# Altium project PROC114E3_SCH.PrjPcb (part 10 of 22)

## Sheet 23.SchDoc
size 513 x 386 mm
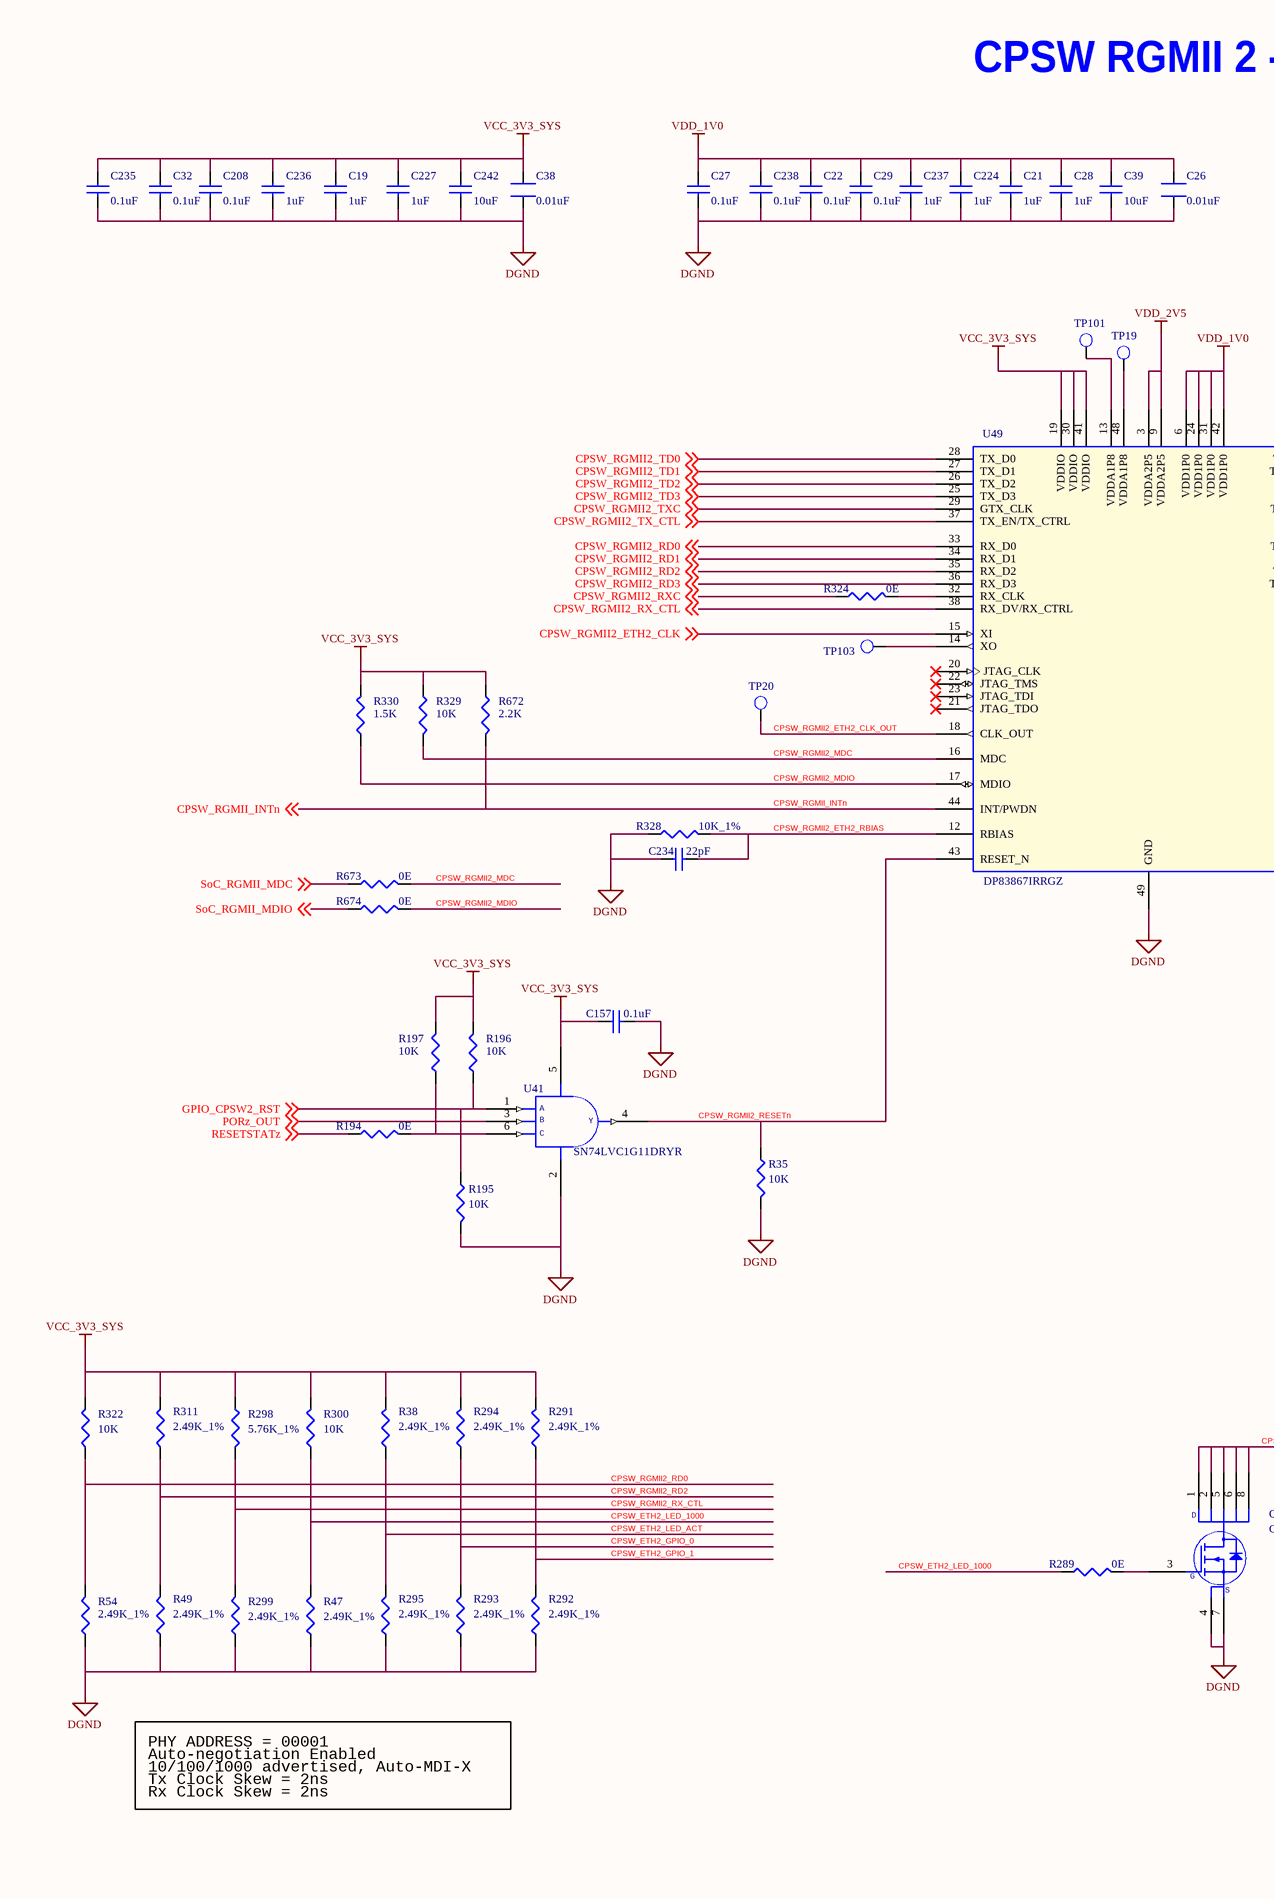
[diagram p35: 23.SchDoc, left]
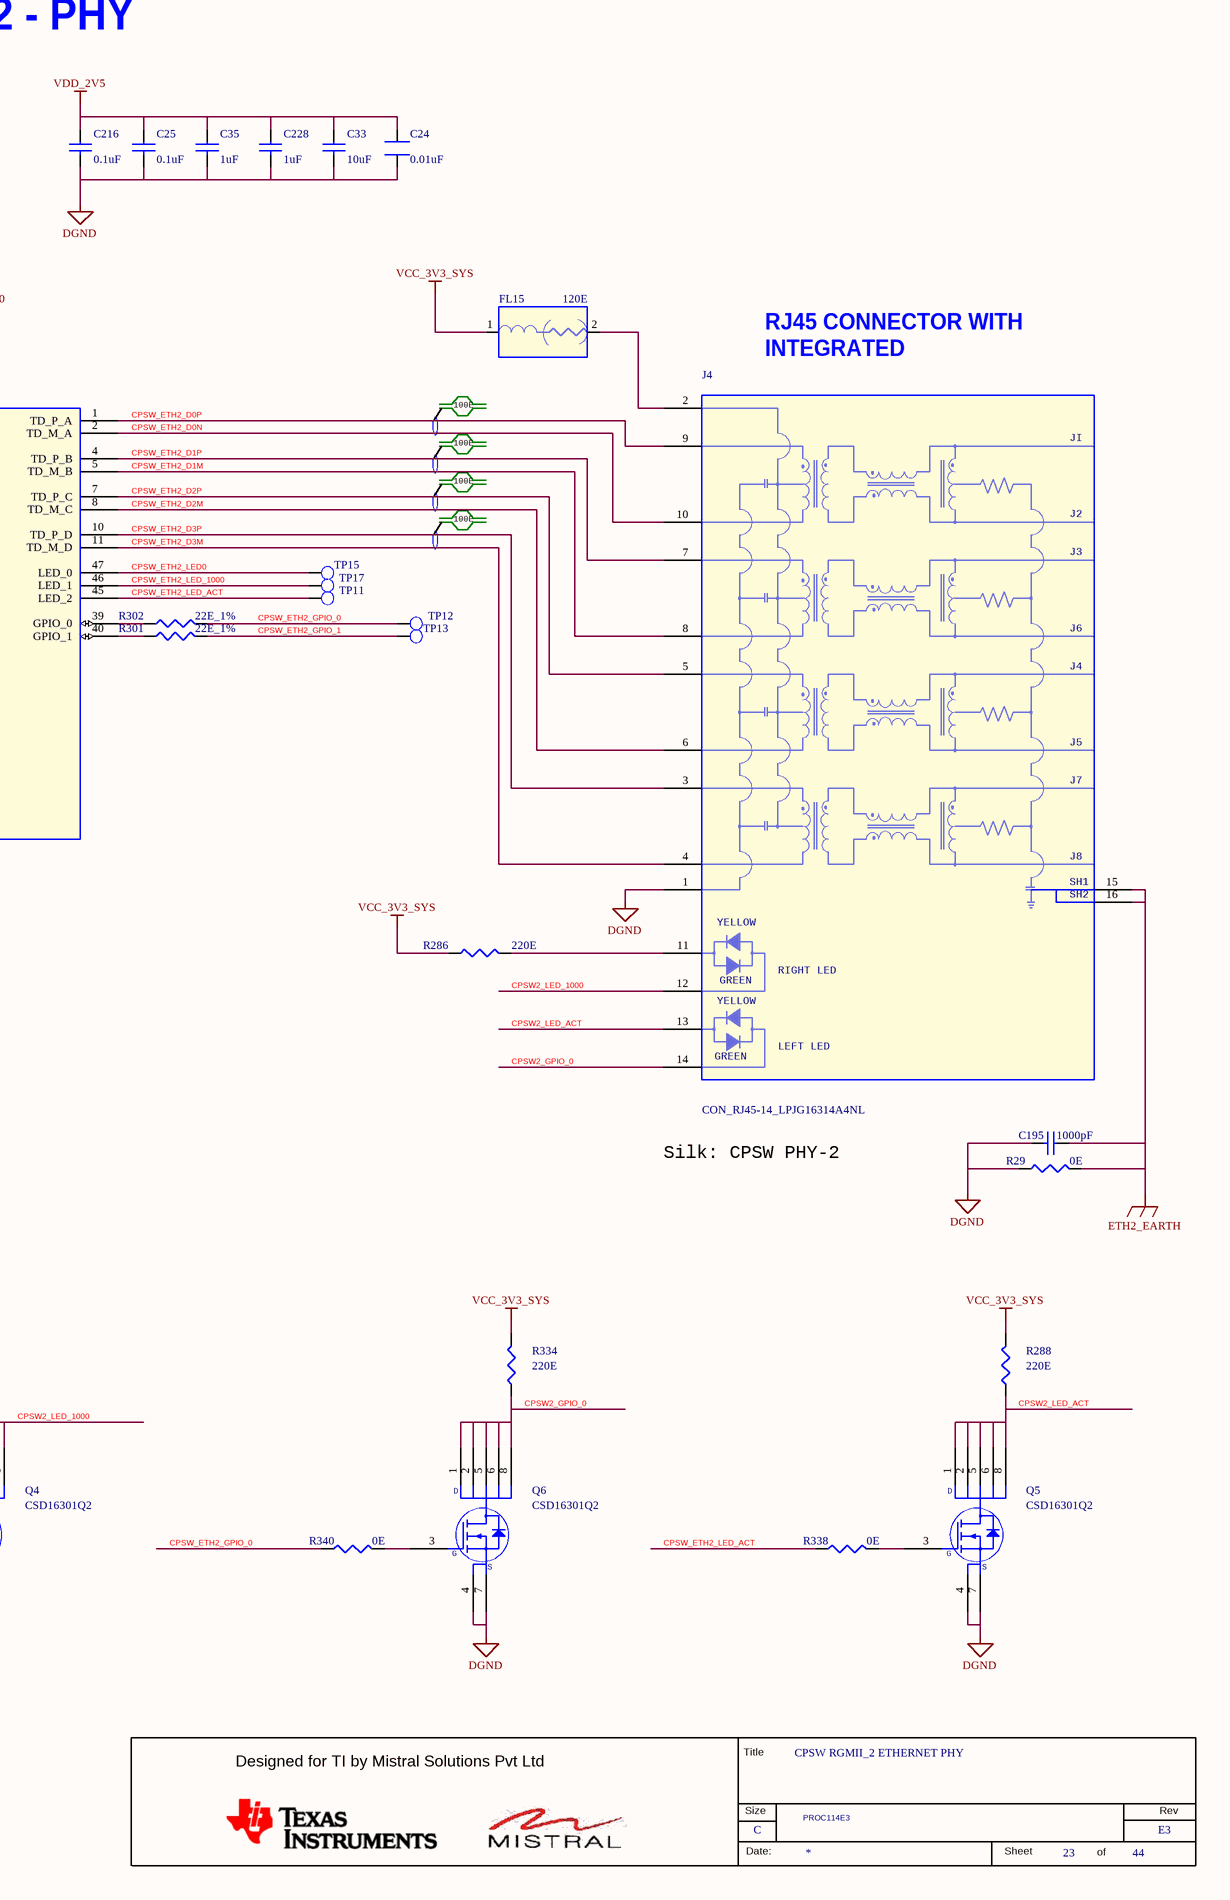
[diagram p36: 23.SchDoc, right]

### Parts
(Parts that share a designator on the sheet are numbered #1, #2 ... from top to bottom, then left to right.)
*#23  RevCode: E3  Title: CPSW RGMII_2 ETHERNET PHY  Page Size: C  Page Number: 23  Page Count: 44  Variant Name: PROC114E3  (hidden comment: MISTRAL_TITLEBLK_CSIZE)  (graphical)
C19  1uF  [CAP0201_0-5]
C21  1uF  [CAP0201_0-5]
C22  0.1uF  [CAP0201_0-5]
C24  0.01uF  [CAP0402N]
C25  0.1uF  [CAP0201_0-5]
C26  0.01uF  [CAP0402N]
C27  0.1uF  [CAP0201_0-5]
C28  1uF  [CAP0201_0-5]
C29  0.1uF  [CAP0201_0-5]
C32  0.1uF  [CAP0201_0-5]
C33  10uF  [CAP0402_0-75]
C35  1uF  [CAP0201_0-5]
C38  0.01uF  [CAP0402N]
C39  10uF  [CAP0402_0-75]
C157  0.1uF  [CAP0201_0-5]
C195  1000pF  [CAP1206_1-75]
C208  0.1uF  [CAP0201_0-5]
C216  0.1uF  [CAP0201_0-5]
C224  1uF  [CAP0201_0-5]
C227  1uF  [CAP0201_0-5]
C228  1uF  [CAP0201_0-5]
C234  22pF  [CAP0201_0-5]
C235  0.1uF  [CAP0201_0-5]
C236  1uF  [CAP0201_0-5]
C237  1uF  [CAP0201_0-5]
C238  0.1uF  [CAP0201_0-5]
C242  10uF  [CAP0402_0-75]
FL15  120E  [EMIFIL_BLM15P_0402]
J4  CON_RJ45-14_LPJG16314A4NL  [CON_RJ45-14_LPJG16314A4NL_S_R_T_13-6]
Q4  CSD16301Q2  [WSON6_CSD13202Q2_80X80_0-8]
Q5  CSD16301Q2  [WSON6_CSD13202Q2_80X80_0-8]
Q6  CSD16301Q2  [WSON6_CSD13202Q2_80X80_0-8]
R29  0E  [RES0603_0-75]
R35  10K  [RES0201_0-5]
R38  2.49K_1%  [RES0402_0-5]
R47  2.49K_1%  [RES0402_0-5]
R49  2.49K_1%  [RES0402_0-5]
R54  2.49K_1%  [RES0402_0-5]
R194  0E  [RES0402_0-5]
R195  10K  [RES0201_0-5]
R196  10K  [RES0201_0-5]
R197  10K  [RES0201_0-5]
R286  220E  [RES0402_0-5]
R288  220E  [RES0402_0-5]
R289  0E  [RES0402_0-5]
R291  2.49K_1%  [RES0402_0-5]
R292  2.49K_1%  [RES0402_0-5]
R293  2.49K_1%  [RES0402_0-5]
R294  2.49K_1%  [RES0402_0-5]
R295  2.49K_1%  [RES0402_0-5]
R298  5.76K_1%  [RES0402_0-5]
R299  2.49K_1%  [RES0402_0-5]
R300  10K  [RES0201_0-5]
R301  22E_1%  [RES0201_0-5]
R302  22E_1%  [RES0201_0-5]
R311  2.49K_1%  [RES0402_0-5]
R322  10K  [RES0201_0-5]
R324  0E  [RES0402_0-5]
R328  10K_1%  [RES0201_0-5]
R329  10K  [RES0201_0-5]
R330  1.5K  [RES0201_0-5]
R334  220E  [RES0402_0-5]
R338  0E  [RES0402_0-5]
R340  0E  [RES0402_0-5]
R672  2.2K  [RES0201_0-5]
R673  0E  [RES0402_0-5]
R674  0E  [RES0402_0-5]
TP11  TP20_SMD  [TP20_SMD]  (value not drawn)
TP12  TP20_SMD  [TP20_SMD]  (value not drawn)
TP13  TP20_SMD  [TP20_SMD]  (value not drawn)
TP15  TP20_SMD  [TP20_SMD]  (value not drawn)
TP17  TP20_SMD  [TP20_SMD]  (value not drawn)
TP19  TP20_SMD  [TP20_SMD]  (value not drawn)
TP20  TP20_SMD  [TP20_SMD]  (value not drawn)
TP101  TP20_SMD  [TP20_SMD]  (value not drawn)
TP103  TP20_SMD  [TP20_SMD]  (value not drawn)
U41  SN74LVC1G11DRYR  [SON6_SN74LVC2G17_40X60_0-6]
U49  DP83867IRRGZ  [QFN48_19-68_280X280_1]

### Nets
DGND: C19.2 C21.2 C22.2 C24.2 C25.2 C26.2 C27.2 C28.2 C29.2 C32.2 C33.2 C35.2 C38.2 C39.2 C157.2 C195.2 C208.2 C216.2 C224.2 C227.2 C228.2 C234.1 C235.2 C236.2 C237.2 C238.2 C242.2 J4.1(CH-GND) Q4.4(S1) Q4.7(S2) Q5.4(S1) Q5.7(S2) Q6.4(S1) Q6.7(S2) R29.2 R35.2 R47.1 R49.1 R54.1 R195.2 R292.1 R293.1 R295.1 R299.1 R328.2 U41.2(GND) U49.49(GND)
ETH2_EARTH: C195.1 J4.15(SH1) J4.16(SH2) R29.1
VCC_3V3_SYS: C19.1 C32.1 C38.1 C157.1 C208.1 C227.1 C235.1 C236.1 C242.1 FL15.1 R38.2 R196.2 R197.2 R286.1 R288.2 R291.2 R294.2 R298.1 R300.2 R311.2 R322.2 R329.1 R330.2 R334.2 R672.1 U41.5(VCC) U49.19(VDDIO) U49.30(VDDIO) U49.41(VDDIO)
VDD_1V0: C21.1 C22.1 C26.1 C27.1 C28.1 C29.1 C39.1 C224.1 C237.1 C238.1 U49.6(VDD1P0) U49.24(VDD1P0) U49.31(VDD1P0) U49.42(VDD1P0)
VDD_2V5: C24.1 C25.1 C33.1 C35.1 C216.1 C228.1 U49.3(VDDA2P5) U49.9(VDDA2P5)
CPSW2_GPIO_0: J4.14 Q6.1(D1) Q6.2(D2) Q6.5(D3) Q6.6(D4) Q6.8(D5) R334.1
CPSW2_LED_1000: J4.12 Q4.1(D1) Q4.2(D2) Q4.5(D3) Q4.6(D4) Q4.8(D5)
CPSW2_LED_ACT: J4.13 Q5.1(D1) Q5.2(D2) Q5.5(D3) Q5.6(D4) Q5.8(D5) R288.1
CPSW_ETH2_D0N: J4.10(MX0-) U49.2(TD_M_A)
CPSW_ETH2_D0P: J4.9(MX0+) U49.1(TD_P_A)
CPSW_ETH2_D1M: J4.8(MX1-) U49.5(TD_M_B)
CPSW_ETH2_D1P: J4.7(MX1+) U49.4(TD_P_B)
CPSW_ETH2_D2M: J4.6(MX2-) U49.8(TD_M_C)
CPSW_ETH2_D2P: J4.5(MX2+) U49.7(TD_P_C)
CPSW_ETH2_D3M: J4.4(MX3-) U49.11(TD_M_D)
CPSW_ETH2_D3P: J4.3(MX3+) U49.10(TD_P_D)
CPSW_ETH2_GPIO_0: R293.2 R294.1 R302.1 R340.1 TP12.1(TP)
CPSW_ETH2_GPIO_1: R291.1 R292.2 R301.1 TP13.1(TP)
CPSW_ETH2_LED0: TP15.1(TP) U49.47(LED_0)
CPSW_ETH2_LED_1000: R47.2 R289.1 R300.1 TP17.1(TP) U49.46(LED_1)
CPSW_ETH2_LED_ACT: R38.1 R295.2 R338.1 TP11.1(TP) U49.45(LED_2)
CPSW_RGMII2_ETH2_CLK: U49.15(XI) ; off-sheet CPSW_RGMII2_ETH2_CLK
CPSW_RGMII2_ETH2_CLK_OUT: TP20.1(TP) U49.18(CLK_OUT)
CPSW_RGMII2_ETH2_RBIAS: C234.2 R328.1 U49.12(RBIAS)
CPSW_RGMII2_MDC: R329.2 R673.2 U49.16(MDC)
CPSW_RGMII2_MDIO: R330.1 R674.2 U49.17(MDIO)
CPSW_RGMII2_RD0: R54.2 R322.1 U49.33(RX_D0) ; off-sheet CPSW_RGMII2_RD0
CPSW_RGMII2_RD1: U49.34(RX_D1) ; off-sheet CPSW_RGMII2_RD1
CPSW_RGMII2_RD2: R49.2 R311.1 U49.35(RX_D2) ; off-sheet CPSW_RGMII2_RD2
CPSW_RGMII2_RD3: U49.36(RX_D3) ; off-sheet CPSW_RGMII2_RD3
CPSW_RGMII2_RESETn: R35.1 U41.4(Y) U49.43(RESET_N)
CPSW_RGMII2_RX_CTL: R298.2 R299.2 U49.38(RX_DV/RX_CTRL) ; off-sheet CPSW_RGMII2_RX_CTL
CPSW_RGMII2_RXC: R324.1 ; off-sheet CPSW_RGMII2_RXC
CPSW_RGMII2_TD0: U49.28(TX_D0) ; off-sheet CPSW_RGMII2_TD0
CPSW_RGMII2_TD1: U49.27(TX_D1) ; off-sheet CPSW_RGMII2_TD1
CPSW_RGMII2_TD2: U49.26(TX_D2) ; off-sheet CPSW_RGMII2_TD2
CPSW_RGMII2_TD3: U49.25(TX_D3) ; off-sheet CPSW_RGMII2_TD3
CPSW_RGMII2_TX_CTL: U49.37(TX_EN/TX_CTRL) ; off-sheet CPSW_RGMII2_TX_CTL
CPSW_RGMII2_TXC: U49.29(GTX_CLK) ; off-sheet CPSW_RGMII2_TXC
CPSW_RGMII_INTn: R672.2 U49.44(INT/PWDN) ; off-sheet CPSW_RGMII_INTn
GPIO_CPSW2_RST: R195.1 R196.1 U41.1(A) ; off-sheet GPIO_CPSW2_RST
PORz_OUT: U41.3(B) ; off-sheet PORz_OUT
RESETSTATz: R194.1 ; off-sheet RESETSTATz
SoC_RGMII_MDC: R673.1 ; off-sheet SoC_RGMII_MDC
SoC_RGMII_MDIO: R674.1 ; off-sheet SoC_RGMII_MDIO
NetFL15_2: FL15.2 J4.2(VCC)
NetJ4_11: J4.11 R286.2
NetQ4_3: Q4.3(G) R289.2
NetQ5_3: Q5.3(G) R338.2
NetQ6_3: Q6.3(G) R340.2
NetR194_2: R194.2 R197.1 U41.6(C)
NetR301_2: R301.2 U49.40(GPIO_1)
NetR302_2: R302.2 U49.39(GPIO_0)
NetR324_2: R324.2 U49.32(RX_CLK)
NetTP19_1: TP19.1(TP) U49.48(VDDA1P8)
NetTP101_1: TP101.1(TP) U49.13(VDDA1P8)
NetTP103_1: TP103.1(TP) U49.14(XO)

Not connected (* = marked no-connect by the designer): U49 20(JTAG_CLK)* 21(JTAG_TDO)* 22(JTAG_TMS)* 23(JTAG_TDI)*

### Notes on the sheet
- CPSW RGMII 2 - PHY
- (near J4) RJ45 CONNECTOR WITH
  INTEGRATED MAGNETICS
- 100E
- Silk: CPSW PHY-2
- Rx Clock Skew = 2ns
- Tx Clock Skew = 2ns
- Auto-negotiation Enabled
- 10/100/1000 advertised, Auto-MDI-X
- PHY ADDRESS = 00001
- (in symbol CON_RJ45-14_LPJG16314A4NL) JI; J2; J3; J6; J5; J7; J8; YELLOW; RIGHT LED; GREEN; LEFT LED
- (in symbol MISTRAL_TITLEBLK_CSIZE) Title; Designed for TI by Mistral Solutions Pvt Ltd; Size; Rev; Date:; Sheet; of
- (in symbol MOSFET_CSD17313Q2) D; S

### Library data of the parts
*#23 = MISTRAL_TITLEBLK_CSIZE: Issue: 1.0; Page Create Date: March  8, 1995; Page Modify Date: *; Schematic Page Count: 44; Schematic Page Number: 23
C19 C21 C35 C228 C236 C237 = CAP_Dup2: as C71 on sheet 22; PCB Footprint: CAP0201_0-5; Footprint Ref: CAP0201_0-5; Library Ref: CAP; Footprint Path: Y:\MIS_DATABASE\Library\ALTIUM_TOOL\PCB_FOOTPRINTS\Altium_Footprint_Lib.PcbLib; Library Path: Y:\MIS_DATABASE\Library\ALTIUM_TOOL\SCHEMATICS_PARTS\MS_DISCRETE_Library.schlib; MECHANICAL 3D STEP FILE: CAP0201_0-5; Tolerance: 20%; Voltage: 16V; Package: 0201; Distributor_name: DIGIKEY; Distributor_part_number: 490-18654-1-ND; Height: 0.39MM; Weight: 0.33mg; Temperature: -55°C+85°C; Datasheet: Y:\MIS_DATABASE\DATASHEETS\CAPACITORS\GRM033R61C105ME15.PDF; Crtd /date: ALVY/260520; Chkd/date: MANIRAJA/300520
C22 C25 C29 C216 C238 = CAP_Dup2: as C68 on sheet 22; PCB Footprint: CAP0201_0-5; Footprint Path: Y:\MIS_DATABASE\Library\ALTIUM_TOOL\PCB_FOOTPRINTS\Altium_Footprint_Lib.PcbLib; Library Path: Y:\MIS_DATABASE\Library\ALTIUM_TOOL\SCHEMATICS_PARTS\MS_DISCRETE_Library.schlib; Footprint Ref: CAP0201_0-5; Library Ref: CAP; MECHANICAL 3D STEP FILE: CAP0201_0-5; Chkd/date: MANIRAJA/230118; Crtd /date: MANIRAJA/230118; Datasheet: Y:\MIS_DATABASE\DATASHEETS\CAPACITORS\GRM033R61C104KE14.PDF; Temperature: -55°C+85°C; Weight: 0.33mg; Height: 0.33MM; Distributor_part_number: 490-14305-1-ND; Distributor_name: DIGIKEY; Package: 0201; Voltage: 16V; Tolerance: 10%
C24 C38 = CAP_Dup3: as C113 on sheet 21; Library Ref: CAP; Tolerance: 10%; Voltage: 25V; Package: 0201; Distributor_name: DIGIKEY; Distributor_part_number: GRM033R61E103KA12J-ND; Height: 0.33MM; Datasheet: Y:\MIS_DATABASE\DATASHEETS\CAPACITORS\GRM033R61E103KA12.PDF; Crtd /date: MANIRAJA/230118; Chkd/date: MANIRAJA/230118; Weight: 0.33mg; Temperature: -55°C+85°C; MECHANICAL 3D STEP FILE: CAP0201_0-5; Footprint Ref: CAP0201_0-5; Library Path: Y:\MIS_DATABASE\Library\ALTIUM_TOOL\SCHEMATICS_PARTS\MS_DISCRETE_Library.schlib; Footprint Path: Y:\MIS_DATABASE\Library\ALTIUM_TOOL\PCB_FOOTPRINTS\Altium_Footprint_Lib.PcbLib
C26 = CAP_Dup3: as C30 on sheet 21; Footprint Path: Y:\MIS_DATABASE\Library\ALTIUM_TOOL\PCB_FOOTPRINTS\Altium_Footprint_Lib.PcbLib; Library Path: Y:\MIS_DATABASE\Library\ALTIUM_TOOL\SCHEMATICS_PARTS\MS_DISCRETE_Library.schlib; Footprint Ref: CAP0201_0-5; MECHANICAL 3D STEP FILE: CAP0201_0-5; Temperature: -55°C+85°C; Weight: 0.33mg; Chkd/date: MANIRAJA/230118; Crtd /date: MANIRAJA/230118; Datasheet: Y:\MIS_DATABASE\DATASHEETS\CAPACITORS\GRM033R61E103KA12.PDF; Height: 0.33MM; Distributor_part_number: GRM033R61E103KA12J-ND; Distributor_name: DIGIKEY; Package: 0201; Voltage: 25V; Tolerance: 10%; Library Ref: CAP
C27 C32 C157 C208 C235 = CAP_Dup2: as C63 on sheet 22; PCB Footprint: CAP0201_0-5; Tolerance: 10%; Voltage: 16V; Package: 0201; Distributor_name: DIGIKEY; Distributor_part_number: 490-14305-1-ND; Height: 0.33MM; Weight: 0.33mg; Temperature: -55°C+85°C; Datasheet: Y:\MIS_DATABASE\DATASHEETS\CAPACITORS\GRM033R61C104KE14.PDF; Crtd /date: MANIRAJA/230118; Chkd/date: MANIRAJA/230118; MECHANICAL 3D STEP FILE: CAP0201_0-5; Library Ref: CAP; Footprint Ref: CAP0201_0-5; Library Path: Y:\MIS_DATABASE\Library\ALTIUM_TOOL\SCHEMATICS_PARTS\MS_DISCRETE_Library.schlib; Footprint Path: Y:\MIS_DATABASE\Library\ALTIUM_TOOL\PCB_FOOTPRINTS\Altium_Footprint_Lib.PcbLib
C28 C224 C227 = CAP_Dup2: as C47 on sheet 19; PCB Footprint: CAP0201_0-5; Chkd/date: MANIRAJA/300520; Crtd /date: ALVY/260520; Datasheet: Y:\MIS_DATABASE\DATASHEETS\CAPACITORS\GRM033R61C105ME15.PDF; Temperature: -55°C+85°C; Weight: 0.33mg; Height: 0.39MM; Distributor_part_number: 490-18654-1-ND; Distributor_name: DIGIKEY; Package: 0201; Voltage: 16V; Tolerance: 20%; MECHANICAL 3D STEP FILE: CAP0201_0-5; Library Path: Y:\MIS_DATABASE\Library\ALTIUM_TOOL\SCHEMATICS_PARTS\MS_DISCRETE_Library.schlib; Footprint Path: Y:\MIS_DATABASE\Library\ALTIUM_TOOL\PCB_FOOTPRINTS\Altium_Footprint_Lib.PcbLib; Library Ref: CAP; Footprint Ref: CAP0201_0-5
C33 = CAP_Dup2: as C69 on sheet 22; PCB Footprint: CAP0402_0-75; Footprint Path: Y:\MIS_DATABASE\Library\ALTIUM_TOOL\PCB_FOOTPRINTS\Altium_Footprint_Lib.PcbLib; Library Path: Y:\MIS_DATABASE\Library\ALTIUM_TOOL\SCHEMATICS_PARTS\MS_DISCRETE_Library.schlib; Footprint Ref: CAP0402_0-75; Tolerance: 20%; Voltage: 10V; Package: 0402; Distributor_name: DIGIKEY; Distributor_part_number: 490-GRM155R61A106ME11DTR-ND; Height: 0.55MM; Datasheet: Y:\MIS_DATABASE\DATASHEETS\CAPACITORS\MURATA-GXX-SER_NOV17.PDF; Crtd /date: ALVY/260520; Chkd/date: MANIRAJA/300520; Weight: 3.1mg; Temperature: -55°C+85°C; MECHANICAL 3D STEP FILE: CAP0402_0-75; Library Ref: CAP
C39 = CAP_Dup2: CAP CERAMIC 10uF 10V 20% X5R 0402; Part_type: CAPACITORS\CERAMIC; Mfr_part_number: GRM155R61A106ME11D; Mfr_name: MURATA; Mistral Part No: 120013110019-R; Wattage: NA; Custom_Duty: 15%; Customs_HS_Code: 85322990; Project: QCS610_NANOSOM; PCB Footprint: CAP0402_0-75; Footprint Path: Y:\MIS_DATABASE\Library\ALTIUM_TOOL\PCB_FOOTPRINTS\Altium_Footprint_Lib.PcbLib; Library Path: Y:\MIS_DATABASE\Library\ALTIUM_TOOL\SCHEMATICS_PARTS\MS_DISCRETE_Library.schlib; Footprint Ref: CAP0402_0-75; MECHANICAL 3D STEP FILE: CAP0402_0-75; Temperature: -55°C+85°C; Weight: 3.1mg; Chkd/date: MANIRAJA/300520; Crtd /date: ALVY/260520; Datasheet: Y:\MIS_DATABASE\DATASHEETS\CAPACITORS\MURATA-GXX-SER_NOV17.PDF; Height: 0.55MM; Distributor_part_number: 490-GRM155R61A106ME11DTR-ND; Distributor_name: DIGIKEY; Package: 0402; Voltage: 10V; Tolerance: 20%; Library Ref: CAP
C195 = CAP_Dup2: as C327 on sheet 22; PCB Footprint: CAP1206_1-75; Tolerance: 10%; Voltage: 2KV; Package: 1206; Distributor_name: DIGIKEY; Distributor_part_number: 478-2956-1-ND; Height: 1.52MM; Weight: 16.2mg; Temperature: -55°C+125°C; Datasheet: Y:\MIS_DATABASE\DATASHEETS\CAPACITORS\AVX_HV-MLC.PDF; Crtd /date: MAZHAR/281106; Chkd/date: SHREESHAIL/291106; Library Ref: CAP; Footprint Ref: CAP1206_1-75; Library Path: Y:\MIS_DATABASE\Library\ALTIUM_TOOL\SCHEMATICS_PARTS\MS_DISCRETE_Library.schlib; Footprint Path: Y:\MIS_DATABASE\Library\ALTIUM_TOOL\PCB_FOOTPRINTS\Altium_Footprint_Lib.PcbLib; MECHANICAL 3D STEP FILE: CAP1206_1-75
C234 = CAP_Dup2: CAP CERAMIC 22pF 25V 1% C0G(NP0) 0201; Part_type: CAPACITORS\CERAMIC; Mfr_part_number: GRM0335C1E220FA01D; Mfr_name: MURATA; Mistral Part No: 120021070019-R; Custom_Duty: 15%; Customs_HS_Code: 85322990; Wattage: NA; Project: TI_AM335x SK_BRD; PCB Footprint: CAP0201_0-5; Footprint Path: Y:\MIS_DATABASE\Library\ALTIUM_TOOL\PCB_FOOTPRINTS\Altium_Footprint_Lib.PcbLib; Library Path: Y:\MIS_DATABASE\Library\ALTIUM_TOOL\SCHEMATICS_PARTS\MS_DISCRETE_Library.schlib; MECHANICAL 3D STEP FILE: CAP0201_0-5; Chkd/date: MANIRAJA/270721; Crtd /date: ALVY/260721; Datasheet: Y:\MIS_DATABASE\DATASHEETS\CAPACITORS\GRM0335C1E220FA01.PDF; Temperature: -55°C+125°C; Weight: 0.33mg; Height: 0.33MM; Library Ref: CAP; Distributor_part_number: 490-14545-1-ND; Distributor_name: DIGIKEY; Package: 0201; Voltage: 25V; Tolerance: 1%; Footprint Ref: CAP0201_0-5
C242 = CAP_Dup2: as C319 on sheet 22; PCB Footprint: CAP0402_0-75; Footprint Path: Y:\MIS_DATABASE\Library\ALTIUM_TOOL\PCB_FOOTPRINTS\Altium_Footprint_Lib.PcbLib; Library Path: Y:\MIS_DATABASE\Library\ALTIUM_TOOL\SCHEMATICS_PARTS\MS_DISCRETE_Library.schlib; Footprint Ref: CAP0402_0-75; Library Ref: CAP; MECHANICAL 3D STEP FILE: CAP0402_0-75; Temperature: -55°C+85°C; Weight: 3.1mg; Tolerance: 20%; Voltage: 10V; Package: 0402; Distributor_name: DIGIKEY; Distributor_part_number: 490-GRM155R61A106ME11DTR-ND; Height: 0.55MM; Datasheet: Y:\MIS_DATABASE\DATASHEETS\CAPACITORS\MURATA-GXX-SER_NOV17.PDF; Crtd /date: ALVY/260520; Chkd/date: MANIRAJA/300520
FL15 = EMIFILTER_IND: FERRITE CHIP 120E 2A 0402; Mistral Part No: 130013060022-R; Mfr_name: MURATA; Mfr_part_number: BLM15PX121SN1D; Part_type: FILTER; Project: GEN_3-8; Tolerance: 25%; Voltage: NA; Customs_HS_Code: 85369090; Custom_Duty: 24%; PCB Footprint: EMIFIL_BLM15P_0402; Wattage: NA; Package: 0402; Distributor_name: MOUSER; Distributor_part_number: 81-BLM15PX121SN1D; Library Ref: EMIFILTER_IND; Height: 0.55MM; Weight: NA; Temperature: -55°C+125°C; Datasheet: Y:\MIS_DATABASE\DATASHEETS\DISCRETES\INDUCTORS\BLM15X.PDF; Crtd /date: USMAN/170613; Chkd/date: NAVEED/241114
J4 = CON_RJ45-14_LPJG16314A4NL: CON RJ-45 FEMALE 14POS RT TH; Part_type: CONNECTOR\JACK; Mfr_name: LINK-PP; Mistral Part No: 150014060029-R; Custom_Duty: 24%; Customs_HS_Code: 85369090; Wattage: NA; Project: AEGIS; PCB Footprint: CON_RJ45-14_LPJG16314A4NL_S_R_T_13-6; Footprint Path: Y:\MIS_DATABASE\Library\ALTIUM_TOOL\PCB_FOOTPRINTS\Altium_Footprint_Lib.PcbLib; Library Path: Y:\MIS_DATABASE\Library\ALTIUM_TOOL\SCHEMATICS_PARTS\MS_CONNECTOR_Library.schlib; MECHANICAL 3D STEP FILE: CON_RJ45-14_LPJG16314A4NL_S_R_T_13-6; Chkd/date: VASANTHA/150714; Crtd /date: BALACHANDAR/120614; Datasheet: Y:\MIS_DATABASE\DATASHEETS\CONNECTORS\LPJG16314A4NL.PDF; Temperature: -0°C+70°C; Weight: NA; Height: 13.60MM; Footprint Ref: CON_RJ45-14_LPJG16314A4NL_S_R_T_13-6; Library Ref: CON_RJ45-14_LPJG16314A4NL; Distributor_part_number: NA; Distributor_name: NA; Package: THRU-HOLE; Voltage: NA; Tolerance: NA; Mfr_part_number: LPJG16314A4NL
Q4-Q6 = MOSFET_CSD17313Q2: as Q7 on sheet 22; Footprint Ref: WSON6_CSD13202Q2_80X80_0-8; Mfr_part_number: CSD16301Q2; Voltage: NA; Wattage: NA; Package: WSON6; Distributor_name: DIGIKEY; Distributor_part_number: 296-25260-1-ND; Library Ref: MOSFET_CSD17313Q2; PCB Footprint: WSON6_CSD13202Q2_80X80_0-8; Height: 0.80MM; Weight: 8.7mg; Temperature: -55°C+150°C; Datasheet: Y:\MIS_DATABASE\DATASHEETS\ICS\POWER\CSD16301Q2.PDF; Crtd /date: MANIRAJA/071220; Chkd/date: ALVY/071220; MECHANICAL 3D STEP FILE: WSON6_CSD13202Q2_80X80_0-8; Library Path: Y:\MIS_DATABASE\Library\ALTIUM_TOOL\SCHEMATICS_PARTS\MS_MOSFET_Library.schlib; Footprint Path: Y:\MIS_DATABASE\Library\ALTIUM_TOOL\PCB_FOOTPRINTS\Altium_Footprint_Lib.PcbLib
R29 = RESISTOR_Dup6: as R339 on sheet 22; PCB Footprint: RES0603_0-75; Footprint Path: Y:\MIS_DATABASE\Library\ALTIUM_TOOL\PCB_FOOTPRINTS\Altium_Footprint_Lib.PcbLib; Library Path: Y:\MIS_DATABASE\Library\ALTIUM_TOOL\SCHEMATICS_PARTS\MS_DISCRETE_Library.schlib; Footprint Ref: RES0603_0-75; Library Ref: RESISTOR; Tolerance: 5%; Wattage: 1/10W; Package: 0603; Distributor_name: DIGIKEY; Distributor_part_number: 311-0.0GRCT-ND; Height: 0.55MM; Weight: 2mg; Temperature: -55°C+155°C; Datasheet: Y:\MIS_DATABASE\DATASHEETS\RESISTORS\RCXXXXL-SER_MAR18.PDF; Crtd /date: BAVISH/180211; Chkd/date: MANIRAJA/051217; MECHANICAL 3D STEP FILE: RES0603_0-75
R35 R300 R322 = RESISTOR_Dup6: as R427 on sheet 18; PCB Footprint: RES0201_0-5; MECHANICAL 3D STEP FILE: RES0201_0-5; Chkd/date: MANIRAJA/050517; Crtd /date: MANIRAJA/050517; Datasheet: Y:\MIS_DATABASE\DATASHEETS\RESISTORS\RCXXXXL-SER_MAR18.PDF; Temperature: -55°C+125°C; Weight: 0.17mg; Height: 0.26MM; Distributor_part_number: 311-10KNCT-ND; Distributor_name: DIGIKEY; Package: 0201; Wattage: 1/20W; Tolerance: 5%; Library Ref: RESISTOR; Footprint Ref: RES0201_0-5; Library Path: Y:\MIS_DATABASE\Library\ALTIUM_TOOL\SCHEMATICS_PARTS\MS_DISCRETE_Library.schlib; Footprint Path: Y:\MIS_DATABASE\Library\ALTIUM_TOOL\PCB_FOOTPRINTS\Altium_Footprint_Lib.PcbLib
R38 R49 R291-R295 R299 R311 = RESISTOR_Dup6: as R84 on sheet 22; PCB Footprint: RES0402_0-5; Library Ref: RESISTOR; Chkd/date: VASANTHA/270516; Crtd /date: VASANTHA/270516; Datasheet: Y:\MIS_DATABASE\DATASHEETS\RESISTORS\RCXXXXL-SER_MAR18.PDF; Temperature: -55°C+155°C; Weight: 0.65mg; Height: 0.40MM; Distributor_part_number: 311-2.49KLRCT-ND; Distributor_name: DIGIKEY; Package: 0402; Wattage: 1/16W; Tolerance: 1%; Footprint Ref: RES0402_0-5; MECHANICAL 3D STEP FILE: RES0402_0-5; Library Path: Y:\MIS_DATABASE\Library\ALTIUM_TOOL\SCHEMATICS_PARTS\MS_DISCRETE_Library.schlib; Footprint Path: Y:\MIS_DATABASE\Library\ALTIUM_TOOL\PCB_FOOTPRINTS\Altium_Footprint_Lib.PcbLib
R47 R54 = RESISTOR_Dup6: as R76 on sheet 22; PCB Footprint: RES0402_0-5; Footprint Path: Y:\MIS_DATABASE\Library\ALTIUM_TOOL\PCB_FOOTPRINTS\Altium_Footprint_Lib.PcbLib; Library Path: Y:\MIS_DATABASE\Library\ALTIUM_TOOL\SCHEMATICS_PARTS\MS_DISCRETE_Library.schlib; MECHANICAL 3D STEP FILE: RES0402_0-5; Footprint Ref: RES0402_0-5; Tolerance: 1%; Wattage: 1/16W; Package: 0402; Distributor_name: DIGIKEY; Distributor_part_number: 311-2.49KLRCT-ND; Height: 0.40MM; Weight: 0.65mg; Temperature: -55°C+155°C; Datasheet: Y:\MIS_DATABASE\DATASHEETS\RESISTORS\RCXXXXL-SER_MAR18.PDF; Crtd /date: VASANTHA/270516; Chkd/date: VASANTHA/270516; Library Ref: RESISTOR
R194 = RESISTOR_Dup4: as R189 on sheet 22; PCB Footprint: RES0402_0-5; MECHANICAL 3D STEP FILE: RES0402_0-5; Chkd/date: VASANTHA/201216; Crtd /date: MUDDU/190810; Datasheet: Y:\MIS_DATABASE\DATASHEETS\RESISTORS\CRCW0603.PDF; Temperature: -55°C+155°C; Weight: 0.65mg; Height: 0.40MM; Distributor_part_number: 541-0.0JCT-ND; Distributor_name: DIGIKEY; Package: 0402; Wattage: 1/16W; Tolerance: NA; Library Ref: RESISTOR; Footprint Ref: RES0402_0-5; Library Path: Y:\MIS_DATABASE\Library\ALTIUM_TOOL\SCHEMATICS_PARTS\MS_DISCRETE_Library.schlib; Footprint Path: Y:\MIS_DATABASE\Library\ALTIUM_TOOL\PCB_FOOTPRINTS\Altium_Footprint_Lib.PcbLib
R195-R197 R329 = RESISTOR_Dup6: as R117 on sheet 19; PCB Footprint: RES0201_0-5; Footprint Path: Y:\MIS_DATABASE\Library\ALTIUM_TOOL\PCB_FOOTPRINTS\Altium_Footprint_Lib.PcbLib; Library Path: Y:\MIS_DATABASE\Library\ALTIUM_TOOL\SCHEMATICS_PARTS\MS_DISCRETE_Library.schlib; Footprint Ref: RES0201_0-5; Library Ref: RESISTOR; Tolerance: 5%; Wattage: 1/20W; Package: 0201; Distributor_name: DIGIKEY; Distributor_part_number: 311-10KNCT-ND; Height: 0.26MM; Weight: 0.17mg; Temperature: -55°C+125°C; Datasheet: Y:\MIS_DATABASE\DATASHEETS\RESISTORS\RCXXXXL-SER_MAR18.PDF; Crtd /date: MANIRAJA/050517; Chkd/date: MANIRAJA/050517; MECHANICAL 3D STEP FILE: RES0201_0-5
R286 = RESISTOR_Dup6: as R341 on sheet 22; PCB Footprint: RES0402_0-5; Footprint Path: Y:\MIS_DATABASE\Library\ALTIUM_TOOL\PCB_FOOTPRINTS\Altium_Footprint_Lib.PcbLib; Library Path: Y:\MIS_DATABASE\Library\ALTIUM_TOOL\SCHEMATICS_PARTS\MS_DISCRETE_Library.schlib; MECHANICAL 3D STEP FILE: RES0402_0-5; Temperature: -55°C+155°C; Weight: 0.8mg; Library Ref: RESISTOR; Chkd/date: VASANTHA/291216; Crtd /date: GEETHA/260406; Datasheet: Y:\MIS_DATABASE\DATASHEETS\RESISTORS\PAN-ERJSER_NOV17.PDF; Height: 0.40MM; Distributor_part_number: P220JCT-ND; Distributor_name: DIGIKEY; Package: 0402; Wattage: 1/10W; Tolerance: 5%; Footprint Ref: RES0402_0-5
R288 R334 = RESISTOR_Dup6: RES 220E 1/10W 5% 0402; Mistral Part No: 110009030506-R; Mfr_name: PANASONIC-ECG; Mfr_part_number: ERJ-2GEJ221X; Part_type: RESISTORS\FIXED; Project: RED EYE; Customs_HS_Code: 85332119; Custom_Duty: 15%; Voltage: NA; PCB Footprint: RES0402_0-5; Footprint Ref: RES0402_0-5; Tolerance: 5%; Wattage: 1/10W; Package: 0402; Distributor_name: DIGIKEY; Distributor_part_number: P220JCT-ND; Height: 0.40MM; Datasheet: Y:\MIS_DATABASE\DATASHEETS\RESISTORS\PAN-ERJSER_NOV17.PDF; Crtd /date: GEETHA/260406; Chkd/date: VASANTHA/291216; Library Ref: RESISTOR; Weight: 0.8mg; Temperature: -55°C+155°C; MECHANICAL 3D STEP FILE: RES0402_0-5; Library Path: Y:\MIS_DATABASE\Library\ALTIUM_TOOL\SCHEMATICS_PARTS\MS_DISCRETE_Library.schlib; Footprint Path: Y:\MIS_DATABASE\Library\ALTIUM_TOOL\PCB_FOOTPRINTS\Altium_Footprint_Lib.PcbLib
R289 R340 = RESISTOR_Dup6: as R72 on sheet 22; PCB Footprint: RES0402_0-5; Footprint Ref: RES0402_0-5; Voltage: NA; Wattage: 1/16W; Package: 0402; Distributor_name: DIGIKEY; Distributor_part_number: 541-0.0JCT-ND; Library Ref: RESISTOR; Height: 0.40MM; Weight: 0.65mg; Temperature: -55°C+155°C; Datasheet: Y:\MIS_DATABASE\DATASHEETS\RESISTORS\CRCW0603.PDF; Crtd /date: MUDDU/190810; Chkd/date: VASANTHA/201216; MECHANICAL 3D STEP FILE: RES0402_0-5; Library Path: Y:\MIS_DATABASE\Library\ALTIUM_TOOL\SCHEMATICS_PARTS\MS_DISCRETE_Library.schlib; Footprint Path: Y:\MIS_DATABASE\Library\ALTIUM_TOOL\PCB_FOOTPRINTS\Altium_Footprint_Lib.PcbLib
R298 = RESISTOR_Dup6: RES 5.76K 1/10W 1% 0402; Mistral Part No: 110009030945-R; Mfr_name: PANASONIC-ECG; Mfr_part_number: ERJ-2RKF5761X; Part_type: RESISTORS\FIXED; Project: CPB; Customs_HS_Code: 85332119; Custom_Duty: 15%; Voltage: NA; PCB Footprint: RES0402_0-5; Footprint Path: Y:\MIS_DATABASE\Library\ALTIUM_TOOL\PCB_FOOTPRINTS\Altium_Footprint_Lib.PcbLib; Library Path: Y:\MIS_DATABASE\Library\ALTIUM_TOOL\SCHEMATICS_PARTS\MS_DISCRETE_Library.schlib; Library Ref: RESISTOR; Tolerance: 1%; Wattage: 1/10W; Package: 0402; Distributor_name: DIGIKEY; Distributor_part_number: P5.76KLCT-ND; Height: 0.40MM; Datasheet: Y:\MIS_DATABASE\DATASHEETS\RESISTORS\PAN-ERJSER_NOV17.PDF; Crtd /date: USMAN/220808; Chkd/date: MAZHAR/150709; Footprint Ref: RES0402_0-5; Weight: 0.8mg; Temperature: -55°C+155°C; MECHANICAL 3D STEP FILE: RES0402_0-5
R301 R302 = RESISTOR_Dup1: as R353 on sheet 22; PCB Footprint: RES0201_0-5; Footprint Path: Y:\MIS_DATABASE\Library\ALTIUM_TOOL\PCB_FOOTPRINTS\Altium_Footprint_Lib.PcbLib; Library Path: Y:\MIS_DATABASE\Library\ALTIUM_TOOL\SCHEMATICS_PARTS\MS_DISCRETE_Library.schlib; MECHANICAL 3D STEP FILE: RES0201_0-5; Chkd/date: MANIRAJA/080319; Crtd /date: ALVY/080319; Datasheet: Y:\MIS_DATABASE\DATASHEETS\RESISTORS\RCXXXXL-SER_MAR18.PDF; Temperature: -55°C+125°C; Weight: 0.17mg; Height: 0.26MM; Library Ref: RESISTOR; Distributor_part_number: YAG2518CT-ND; Distributor_name: DIGIKEY; Package: 0201; Wattage: 1/20W; Tolerance: 1%; Footprint Ref: RES0201_0-5
R324 = RESISTOR_Dup6: as R312 on sheet 20; PCB Footprint: RES0402_0-5; Footprint Ref: RES0402_0-5; Voltage: NA; Wattage: 1/16W; Package: 0402; Distributor_name: DIGIKEY; Distributor_part_number: 541-0.0JCT-ND; Library Ref: RESISTOR; Height: 0.40MM; Weight: 0.65mg; Temperature: -55°C+155°C; Datasheet: Y:\MIS_DATABASE\DATASHEETS\RESISTORS\CRCW0603.PDF; Crtd /date: MUDDU/190810; Chkd/date: VASANTHA/201216; MECHANICAL 3D STEP FILE: RES0402_0-5; Library Path: Y:\MIS_DATABASE\Library\ALTIUM_TOOL\SCHEMATICS_PARTS\MS_DISCRETE_Library.schlib; Footprint Path: Y:\MIS_DATABASE\Library\ALTIUM_TOOL\PCB_FOOTPRINTS\Altium_Footprint_Lib.PcbLib
R328 = RESISTOR_Dup6: as R361 on sheet 22; PCB Footprint: RES0201_0-5; Footprint Path: Y:\MIS_DATABASE\Library\ALTIUM_TOOL\PCB_FOOTPRINTS\Altium_Footprint_Lib.PcbLib; Library Path: Y:\MIS_DATABASE\Library\ALTIUM_TOOL\SCHEMATICS_PARTS\MS_DISCRETE_Library.schlib; Footprint Ref: RES0201_0-5; MECHANICAL 3D STEP FILE: RES0201_0-5; Chkd/date: VASANTHA/270117; Crtd /date: MANIRAJA/270117; Datasheet: Y:\MIS_DATABASE\DATASHEETS\RESISTORS\RCXXXXL-SER_MAR18.PDF; Temperature: -55°C+125°C; Weight: 0.17mg; Height: 0.26MM; Distributor_part_number: 311-10.0KMCT-ND; Distributor_name: DIGIKEY; Package: 0201; Wattage: 1/20W; Tolerance: 1%; Mfr_name: YAGEO AMERICA; Library Ref: RESISTOR
R330 = RESISTOR_Dup6: RES 1.5K 1/20W 5% 0201; Manufacturer: PANASONIC-ECG; Part_type: RESISTORS\FIXED; Mfr_part_number: RC0201JR-071K5L; Mfr_name: YAGEO AMERICA; Mistral Part No: 110010070057-R; Custom_Duty: 15%; Customs_HS_Code: 85332119; Voltage: NA; Project: TI_AM62x_SKEVM_BRD; PCB Footprint: RES0201_0-5; Footprint Path: Y:\MIS_DATABASE\Library\ALTIUM_TOOL\PCB_FOOTPRINTS\Altium_Footprint_Lib.PcbLib; Library Path: Y:\MIS_DATABASE\Library\ALTIUM_TOOL\SCHEMATICS_PARTS\MS_DISCRETE_Library.schlib; MECHANICAL 3D STEP FILE: RES0201_0-5; Chkd/date: ALVY/070422; Crtd /date: TAMILARASU/070422; Datasheet: Y:\MIS_DATABASE\DATASHEETS\RESISTORS\RCXXXXL-SER_MAR18.PDF; Temperature: -55°C+125°C; Weight: 0.17mg; Height: 0.26MM; Library Ref: RESISTOR; Distributor_part_number: 311-1.5KNCT-ND; Distributor_name: DIGIKEY; Package: 0201; Wattage: 1/20W; Tolerance: 5%; Footprint Ref: RES0201_0-5
R338 R673 R674 = RESISTOR_Dup6: as R321 on sheet 20; PCB Footprint: RES0402_0-5; Footprint Path: Y:\MIS_DATABASE\Library\ALTIUM_TOOL\PCB_FOOTPRINTS\Altium_Footprint_Lib.PcbLib; Library Path: Y:\MIS_DATABASE\Library\ALTIUM_TOOL\SCHEMATICS_PARTS\MS_DISCRETE_Library.schlib; MECHANICAL 3D STEP FILE: RES0402_0-5; Chkd/date: VASANTHA/201216; Crtd /date: MUDDU/190810; Datasheet: Y:\MIS_DATABASE\DATASHEETS\RESISTORS\CRCW0603.PDF; Temperature: -55°C+155°C; Weight: 0.65mg; Height: 0.40MM; Library Ref: RESISTOR; Distributor_part_number: 541-0.0JCT-ND; Distributor_name: DIGIKEY; Package: 0402; Wattage: 1/16W; Tolerance: NA; Footprint Ref: RES0402_0-5
R672 = RESISTOR_Dup6: as R363 on sheet 22; Footprint Path: Y:\MIS_DATABASE\Library\ALTIUM_TOOL\PCB_FOOTPRINTS\Altium_Footprint_Lib.PcbLib; Library Path: Y:\MIS_DATABASE\Library\ALTIUM_TOOL\SCHEMATICS_PARTS\MS_DISCRETE_Library.schlib; MECHANICAL 3D STEP FILE: RES0201_0-5; Chkd/date: VASANTHA/010117; Crtd /date: MAZHAR/010605; Datasheet: Y:\MIS_DATABASE\DATASHEETS\RESISTORS\PAN-ERJXGE-FEB06.PDF; Temperature: -55°C+125°C; Weight: 0.15mg; Height: 0.26MM; Library Ref: RESISTOR; Distributor_part_number: P2.2KAGCT-ND; Distributor_name: DIGIKEY; Package: 0201; Wattage: 1/20W; Tolerance: 5%; Footprint Ref: RES0201_0-5; PCB Footprint: RES0201_0-5
TP11 TP17 TP20 TP103 = TESTPOINT: as TP23 on sheet 22; PCB Footprint: TP20_SMD; Customs_HS_Code: NA; Footprint Path: Y:\MIS_DATABASE\Library\ALTIUM_TOOL\PCB_FOOTPRINTS\Altium_Footprint_Lib.PcbLib; Library Path: Y:\MIS_DATABASE\Library\ALTIUM_TOOL\SCHEMATICS_PARTS\MS_DISCRETE_Library.schlib; MECHANICAL 3D STEP FILE: NA; Datasheet: NA; Temperature: NA; Weight: NA; Wattage: NA; Voltage: NA; Tolerance: NA; Mistral Part No: NA; Mfr_part_number: TP20_SMD; Part_type: TESTPOINT; Package: SMD; Distributor_name: NA; Distributor_part_number: NA; Height: NA; Crtd /date: MAZHAR/171006; Chkd/date: SHREESHAIL/171006; Library Ref: TESTPOINT; Footprint Ref: TP20_SMD; RoHS: NA
TP12 = TESTPOINT: as TP22 on sheet 22; PCB Footprint: TP20_SMD; RoHS: NA; Footprint Ref: TP20_SMD; Library Ref: TESTPOINT; Chkd/date: SHREESHAIL/171006; Crtd /date: MAZHAR/171006; Height: NA; Distributor_part_number: NA; Distributor_name: NA; Package: SMD; Part_type: TESTPOINT; Mfr_part_number: TP20_SMD; Tolerance: NA; Voltage: NA; Wattage: NA; Weight: NA; Temperature: NA; Datasheet: NA; MECHANICAL 3D STEP FILE: NA; Library Path: Y:\MIS_DATABASE\Library\ALTIUM_TOOL\SCHEMATICS_PARTS\MS_DISCRETE_Library.schlib; Footprint Path: Y:\MIS_DATABASE\Library\ALTIUM_TOOL\PCB_FOOTPRINTS\Altium_Footprint_Lib.PcbLib; Customs_HS_Code: NA; Custom_Duty: NA
TP13 TP15 TP19 TP101 = TESTPOINT: as TP90 on sheet 18; PCB Footprint: TP20_SMD; Mfr_part_number: TP20_SMD; Part_type: TESTPOINT; Package: SMD; Distributor_name: NA; Distributor_part_number: NA; Height: NA; Crtd /date: MAZHAR/171006; Chkd/date: SHREESHAIL/171006; Tolerance: NA; Voltage: NA; Wattage: NA; Weight: NA; Temperature: NA; Datasheet: NA; MECHANICAL 3D STEP FILE: NA; Library Path: Y:\MIS_DATABASE\Library\ALTIUM_TOOL\SCHEMATICS_PARTS\MS_DISCRETE_Library.schlib; Footprint Path: Y:\MIS_DATABASE\Library\ALTIUM_TOOL\PCB_FOOTPRINTS\Altium_Footprint_Lib.PcbLib; Library Ref: TESTPOINT; Footprint Ref: TP20_SMD; RoHS: NA; Customs_HS_Code: NA; Custom_Duty: NA
U41 = SN74LVC1G11DCKR_SC70-6: IC SINGLE 3-INPUT POSITIVE-AND GATE SON6; Part_type: ICS\DIGITAL\GATES; Mfr_name: TEXAS INSTRUMENTS; Mistral Part No: 141021010013-R; Custom_Duty: 15%; Customs_HS_Code: 85423100; Wattage: NA; Project: AM64X_SKEVM; PCB Footprint: SON6_SN74LVC2G17_40X60_0-6; Footprint Path: Y:\MIS_DATABASE\Library\ALTIUM_TOOL\PCB_FOOTPRINTS\Altium_Footprint_Lib.PcbLib; Library Path: Y:\MIS_DATABASE\Library\ALTIUM_TOOL\SCHEMATICS_PARTS\MS_GATE_Library.schlib; MECHANICAL 3D STEP FILE: SON6_SN74LVC2G17_40X60_0-6; Chkd/date: MANIRAJA/270121; Crtd /date: ALVY/270121; Datasheet: Y:\MIS_DATABASE\DATASHEETS\ICS\DIGITAL\GATES\SN74LVC1G_NOV16.PDF; Temperature: -40°C+125°C; Weight: 33mg; Height: 0.60MM; Library Ref: SN74LVC1G11DCKR_SC70-6; Distributor_part_number: 296-30120-1-ND; Distributor_name: DIGIKEY; Package: SON6; Voltage: NA; Tolerance: NA; Mfr_part_number: SN74LVC1G11DRYR; Footprint Ref: SON6_SN74LVC2G17_40X60_0-6
U49 = DP83867IRRGZ_VQFN48: as U51 on sheet 22; PCB Footprint: QFN48_19-68_280X280_1; MECHANICAL 3D STEP FILE: QFN48_19-68_280X280_1; Chkd/date: MANIRAJA/110817; Crtd /date: MANIRAJA/110817; Datasheet: Y:\MIS_DATABASE\DATASHEETS\ICS\DIGITAL\BUSTRANSCEIVER\DP83867I.PDF; Temperature: -40°C+85°C; Weight: NA; Height: 1.00MM; Distributor_part_number: DP83867IRRGZT-ND; Distributor_name: DIGIKEY; Package: VQFN48; Voltage: NA; Tolerance: NA; Mfr_part_number: DP83867IRRGZ; Library Ref: DP83867IRRGZ_VQFN48